# EAGLE design delay_line (EAGLE 9.0.0)
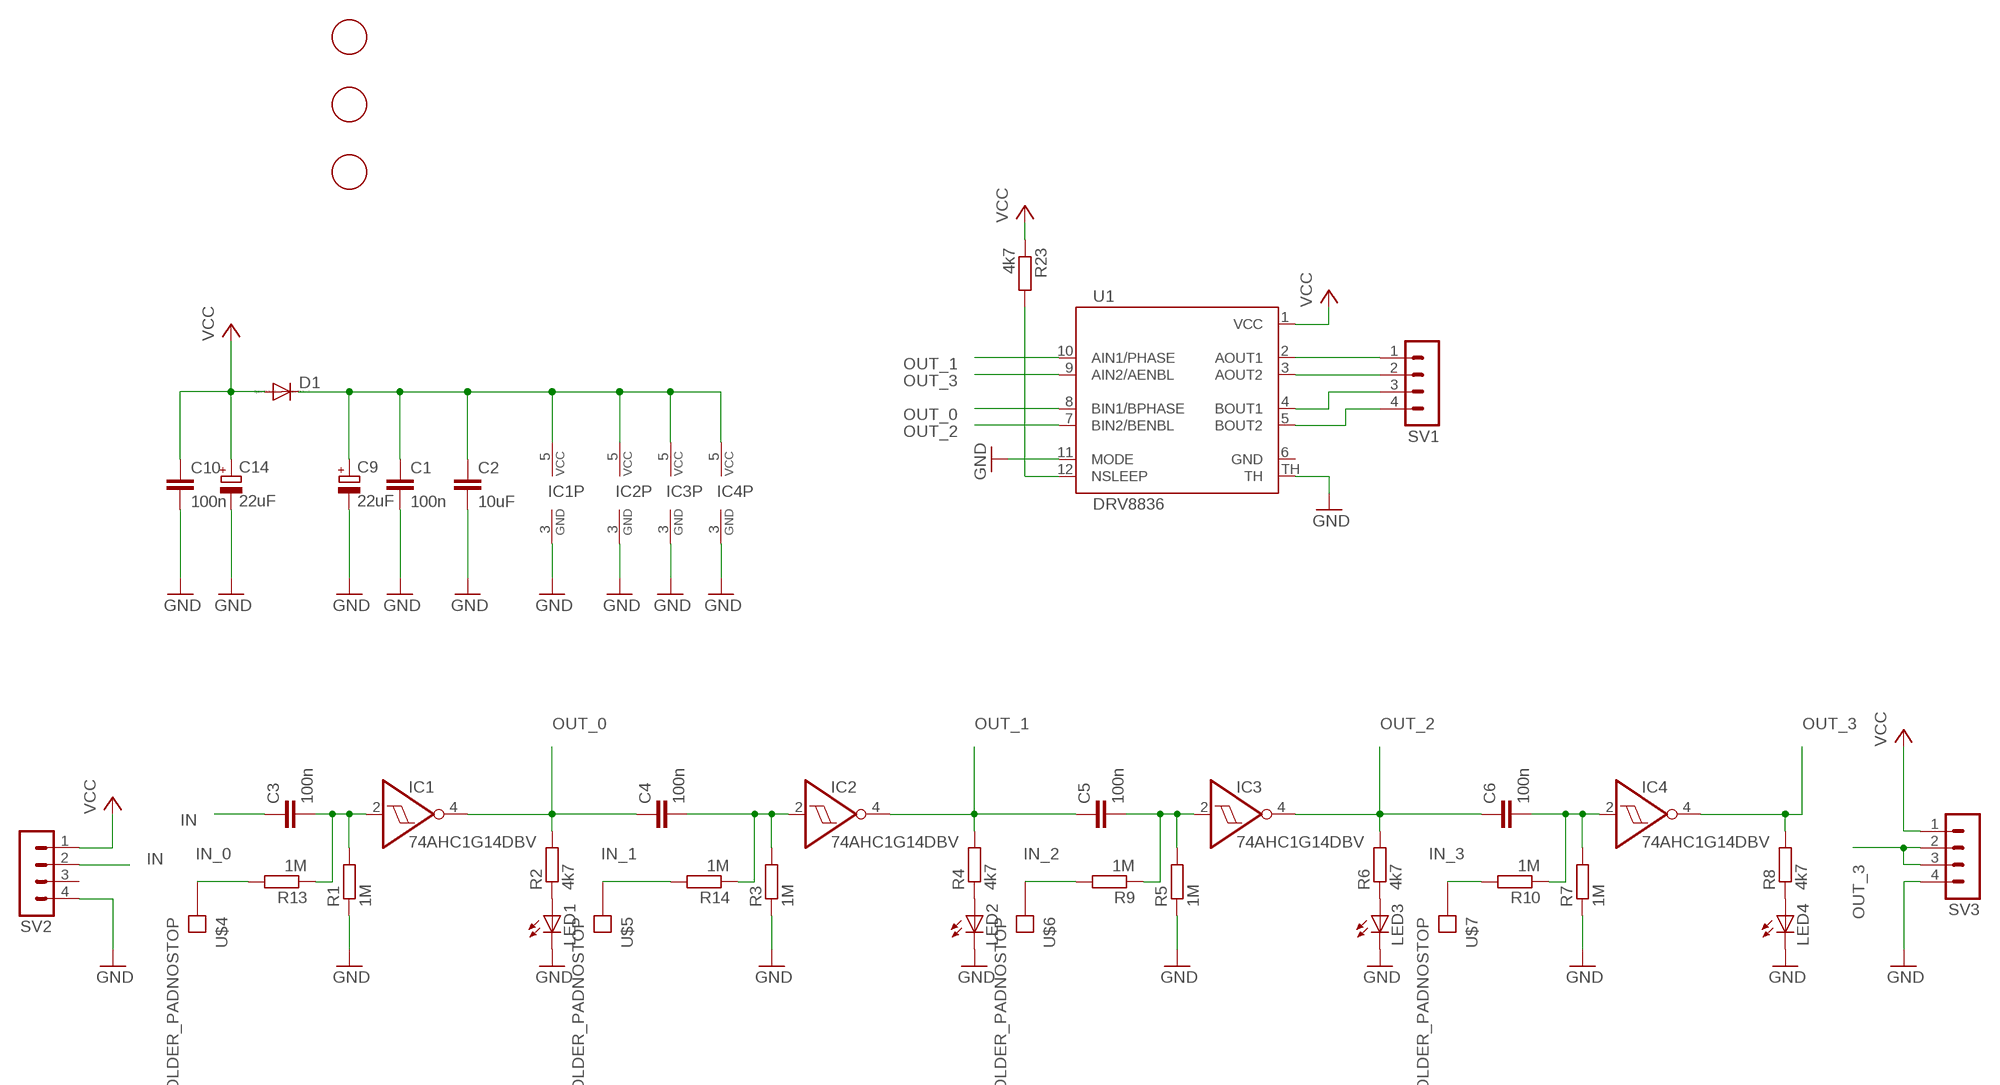
[diagram p0: schematic, sheet 1]

## Parts
C1  100n  C-EUC0805  [C0805]
C2  10uF  C-EUC0805  [C0805]
C3  100n  C-EUC0805  [C0805]
C4  100n  C-EUC0805  [C0805]
C5  100n  C-EUC0805  [C0805]
C6  100n  C-EUC0805  [C0805]
C9  22uF  CPOL-EU153CLV-0605  [153CLV-0605]
C10  100n  C-EUC0805  [C0805]
C14  22uF  CPOL-EU153CLV-0605  [153CLV-0605]
D1  DIODE-DO214AA  [DO214AA]
IC1  74AHC1G14DBV  [SOT23-5]
IC2  74AHC1G14DBV  [SOT23-5]
IC3  74AHC1G14DBV  [SOT23-5]
IC4  74AHC1G14DBV  [SOT23-5]
LED1  LEDSML1206  [SML1206]
LED2  LEDSML1206  [SML1206]
LED3  LEDSML1206  [SML1206]
LED4  LEDSML1206  [SML1206]
R1  1M  R-EU_M0805  [M0805]
R2  4k7  R-EU_M0805  [M0805]
R3  1M  R-EU_M0805  [M0805]
R4  4k7  R-EU_M0805  [M0805]
R5  1M  R-EU_M0805  [M0805]
R6  4k7  R-EU_M0805  [M0805]
R7  1M  R-EU_M0805  [M0805]
R8  4k7  R-EU_M0805  [M0805]
R9  1M  R-EU_M0805  [M0805]
R10  1M  R-EU_M0805  [M0805]
R13  1M  R-EU_M0805  [M0805]
R14  1M  R-EU_M0805  [M0805]
R23  4k7  R-EU_M0805  [M0805]
SV1  MA04-1  [MA04-1]
SV2  MA04-1  [MA04-1]
SV3  MA04-1  [MA04-1]
U1  DRV8836  [12WSON]
U$1  ADAFRUIT_FIDUCIAL  [ADAFRUIT_FIDUCIAL_1MM]
U$2  ADAFRUIT_FIDUCIAL  [ADAFRUIT_FIDUCIAL_1MM]
U$3  ADAFRUIT_FIDUCIAL  [ADAFRUIT_FIDUCIAL_1MM]
U$4  SOLDER_PADNOSTOP  [SOLDER_PAD_NOSTOP]
U$5  SOLDER_PADNOSTOP  [SOLDER_PAD_NOSTOP]
U$6  SOLDER_PADNOSTOP  [SOLDER_PAD_NOSTOP]
U$7  SOLDER_PADNOSTOP  [SOLDER_PAD_NOSTOP]

## Nets
GND: C1.2 C2.2 C9.- C10.2 C14.- IC1.3(GND) IC2.3(GND) IC3.3(GND) IC4.3(GND) LED1.C LED2.C LED3.C LED4.C R1.1 R3.1 R5.1 R7.1 SV2.4 SV3.4 U1.11(MODE) U1.TH
IN: C3.1 SV2.2
IN_0: R13.2 U$4.SPAD(NET)
IN_1: R14.2 U$5.SPAD(NET)
IN_2: R9.2 U$6.SPAD(NET)
IN_3: R10.2 U$7.SPAD(NET)
N$1: C1.1 C2.1 C9.+ D1.C IC1.5(VCC) IC2.5(VCC) IC3.5(VCC) IC4.5(VCC)
N$2: C3.2 IC1.2(I) R1.2 R13.1
N$3: C5.2 IC3.2(I) R5.2 R9.1
N$4: C4.2 IC2.2(I) R3.2 R14.1
N$5: LED1.A R2.1
N$6: LED3.A R6.1
N$7: LED2.A R4.1
N$8: C6.2 IC4.2(I) R7.2 R10.1
N$9: LED4.A R8.1
N$30: SV1.4 U1.5(BOUT2)
N$31: SV1.3 U1.4(BOUT1)
N$32: R23.2 U1.12(NSLEEP)
N$33: SV1.2 U1.3(AOUT2)
N$34: SV1.1 U1.2(AOUT1)
OUT_0: C4.1 IC1.4(O) R2.2 U1.8(BIN1/BPHASE)
OUT_1: C5.1 IC2.4(O) R4.2 U1.10(AIN1/PHASE)
OUT_2: C6.1 IC3.4(O) R6.2 U1.7(BIN2/BENBL)
OUT_3: IC4.4(O) R8.2 SV3.2 SV3.3 U1.9(AIN2/AENBL)
VCC: C10.1 C14.+ D1.A R23.1 SV2.1 SV3.1 U1.1(VCC)
Unconnected: SV2.3 U1.6(GND)

## Library data of the parts
C1-C6 C10 = resistor:C-EU: CAPACITOR, European symbol
C9 C14 = resistor:CPOL-EU: POLARIZED CAPACITOR, European symbol
D1 = diode:DIODE-: DIODE
IC1-IC4 = 74xx-little-de:74*1G14: Single Schmitt-Trigger Inverter Gate
LED1-LED4 = led:LED: LED OSRAM: - CHIPLED LG R971, LG N971, LY N971, LG Q971, LY Q971, LO R971, LY R971 LH N974, LH R974 LS Q976, LO Q976, LY Q976 LO Q996 - Hyper CHIPLED LW Q18S LB Q993, LB Q99A, LB R99A - SideLED LS A670, LO A670, LY A670, LG A670, LP A670 LB A673, LV A673, LT A673, LW A673 LH A674 LY A675 LS A676, LA A676, LO A676, LY A676, LW A676 LS A679, LY A679, LG A679 - Hyper Micro SIDELED® LS Y876, LA Y876, LO Y876, LY Y876 LT Y87S - SmartLED LW L88C, LW L88S LB L89C, LB L89S, LG L890 LS L89K, LO L89K, LY L89K LS L896, LA L896, LO L896, LY L896 - TOPLED LS T670, LO T670, LY T670, LG T670, LP T670 LSG T670, LSP T670, LSY T670, LOP T670, LYG T670 LG T671, LOG T671, LSG T671 LB T673, LV T673, LT T673, LW T673 LH T674 LS T676, LA T676, LO T676, LY T676, LB T676, LH T676, LSB T676, LW T676 LB T67C, LV T67C, LT T67C, LS T67K, LO T67K, LY T67K, LW E67C LS E67B, LA E67B, LO E67B, LY E67B, LB E67C, LV E67C, LT E67C LW T67C LS T679, LY T679, LG T679 LS T770, LO T770, LY T770, LG T770, LP T770 LB T773, LV T773, LT T773, LW T773 LH T774 LS E675, LA E675, LY E675, LS T675 LS T776, LA T776, LO T776, LY T776, LB T776 LHGB T686 LT T68C, LB T68C - Hyper Mini TOPLED® LB M676 - Mini TOPLED Santana® LG M470 LS M47K, LO M47K, LY M47K Source: http://www.osram.convergy.de LUXEON: - LUMILED® LXK2-PW12-R00, LXK2-PW12-S00, LXK2-PW14-U00, LXK2-PW14-V00 LXK2-PM12-R00, LXK2-PM12-S00, LXK2-PM14-U00 LXK2-PE12-Q00, LXK2-PE12-R00, LXK2-PE12-S00, LXK2-PE14-T00, LXK2-PE14-U00 LXK2-PB12-K00, LXK2-PB12-L00, LXK2-PB12-M00, LXK2-PB14-N00, LXK2-PB14-P00, LXK2-PB14-Q00 LXK2-PR12-L00, LXK2-PR12-M00, LXK2-PR14-Q00, LXK2-PR14-R00 LXK2-PD12-Q00, LXK2-PD12-R00, LXK2-PD12-S00 LXK2-PH12-R00, LXK2-PH12-S00 LXK2-PL12-P00, LXK2-PL12-Q00, LXK2-PL12-R00 Source: www.luxeon.com KINGBRIGHT: KA-3528ASYC Source: www.kingbright.com
R1-R10 R13 R14 R23 = resistor:R-EU_: RESISTOR, European symbol
SV1-SV3 = con-lstb:MA04-1: PIN HEADER; OC_FARNELL: unknown; OC_NEWARK: unknown
U1 = balto:DRV8836: Dual low voltage H-Bridge IC
U$1-U$3 = main_board:ADAFRUIT_FIDUCIAL: For use by pick and place machines to calibrate the vision/machine, 1mm By microbuilder.eu
U$4-U$7 = JCM:SOLDER_PAD

## Board
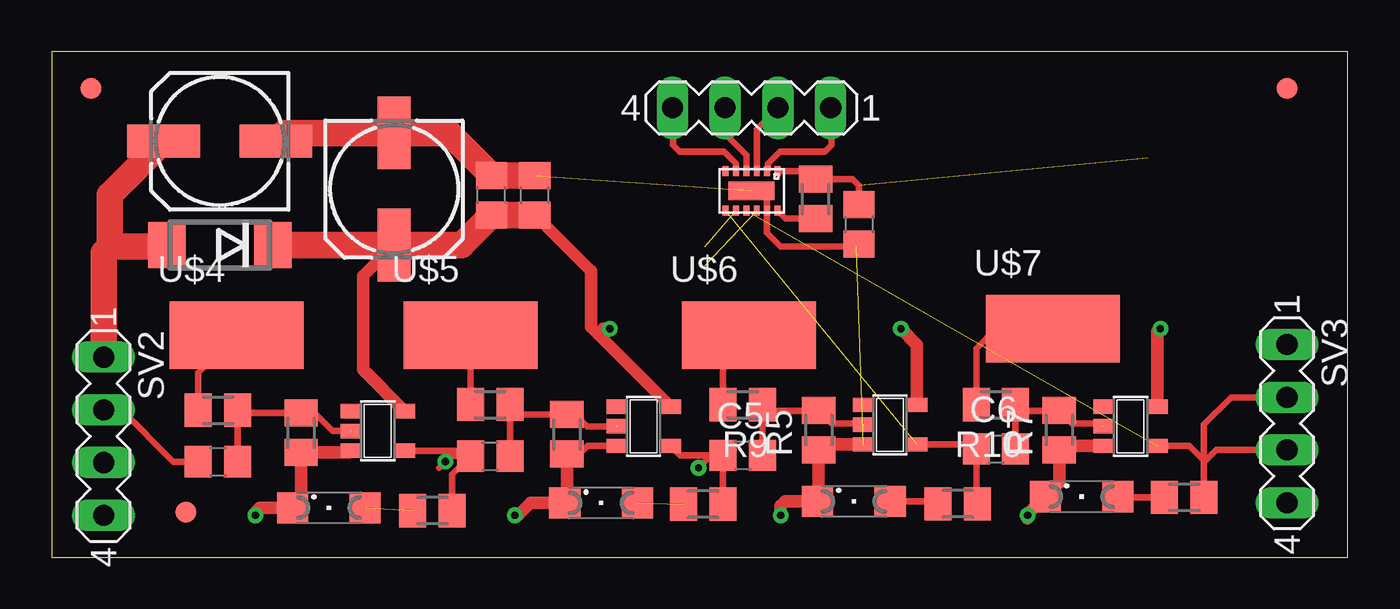
[diagram p1: board, top side]
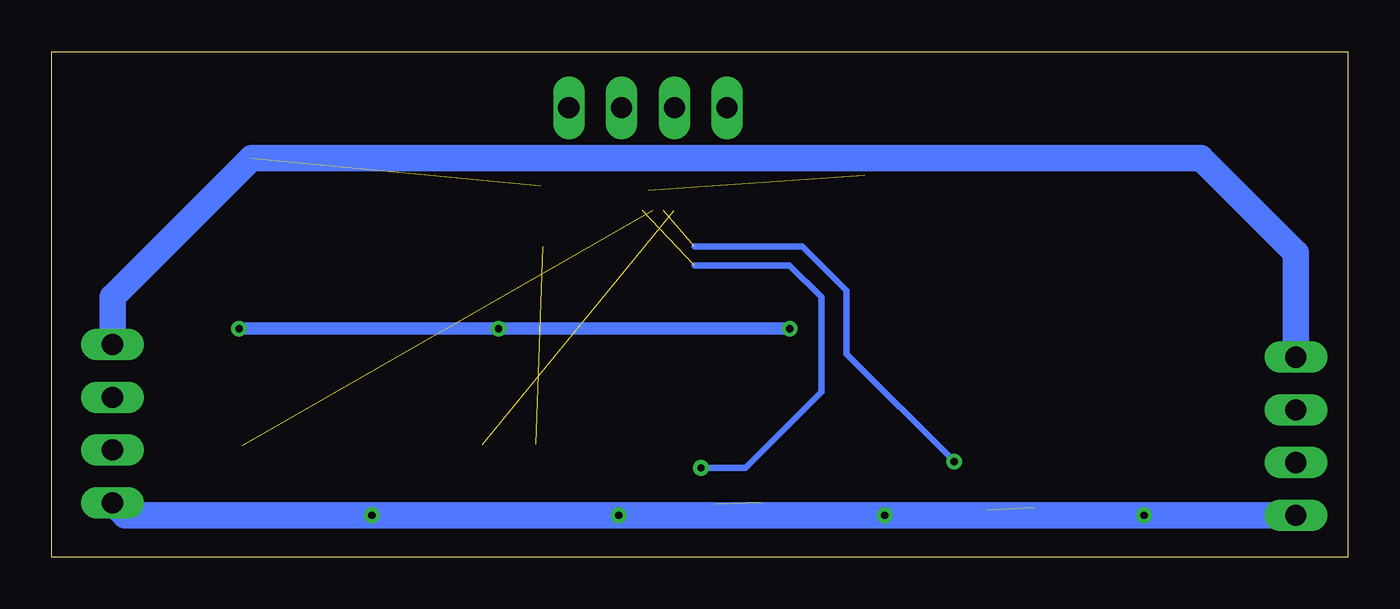
[diagram p2: board, bottom side, seen from below]

Size 62.4 x 24.34 mm. Coordinates in mm from the lower left corner, seen from the top.
Outline: 0,0 62.4,0 62.4,24.34 0,24.34 0,0
Copper layers (1*16): Top 0.035mm / dielectric 1.5mm / Bottom 0.035mm
Design rules "default": minimum track width 6mil, minimum drill 0.35mm, track to track 6mil, track to pad 6mil, pad to pad 6mil, via to via 6mil, smd to smd 6mil, copper to edge 40mil, drill to drill 6mil, minimum pad ring 10mil, minimum via ring 8mil, stop-mask expansion 4mil, vias tented up to drill 0mil, thermal gap 10mil

### Footprints (pad centres in the part's own frame; a part is rotated, then mirrored left to right if it is on the bottom)
C0805 = smd 1.3 x 1.5: 1 -0.95,0; 2 0.95,0
153CLV-0605 = smd 3.5 x 1.6: + 2.7,0; - -2.7,0
DO214AA = smd 1.8 x 2.2: A 2.55,0; C -2.55,0
SOT23-5 = smd 0.69 x 0.99: 1 -0.95,-1.29; 2 0,-1.29; 3 0.95,-1.29; 4 0.95,1.3; 5 -0.95,1.3
SML1206 = smd 1.5 x 1.5: A 1.75,0; C -1.75,0
M0805 = smd 1.3 x 1.6: 1 -0.95,0; 2 0.95,0
MA04-1 = drill 1.016 long: 1 -3.81,0; 2 -1.27,0; 3 1.27,0; 4 3.81,0
12WSON = smd 0.28 x 0.5: 1 -1.25,-0.95; 2 -0.75,-0.95; 3 -0.25,-0.95; 4 0.25,-0.95; 5 0.75,-0.95; 6 1.25,-0.95; 7 1.25,0.95; 8 0.75,0.95; 9 0.25,0.95; 10 -0.25,0.95; 11 -0.75,0.95; 12 -1.25,0.95 | smd 2.2 x 0.9: TH 0,0
ADAFRUIT_FIDUCIAL_1MM = smd 1 x 1: 1 0,0
SOLDER_PAD_NOSTOP = smd 6.452 x 3.251: SPAD 0,0

### Placement (x,y rotation side)
C1  23.26,17.43 90 top
C2  21.17,17.43 90 top
C3  8,4.6 0 top
C4  21.11,4.87 0 top
C5  33.27,4.91 0 top
C6  45.46,5.21 0 top
C9  16.48,17.73 270 top
C10  38.87,16.04 270 top
C14  8.09,20.04 180 top
D1  8.09,15.04 180 top
IC1  15.7,6.08 270 top
IC2  28.5,6.3 270 top
IC3  40.36,6.38 270 top
IC4  51.95,6.3 270 top
LED1  13.34,2.38 0 top
LED2  26.45,2.61 0 top
LED3  38.62,2.68 0 top
LED4  49.59,2.91 0 top
R1  12,5.99 90 top
R2  18.33,2.24 0 top
R3  24.8,5.91 90 top
R4  31.36,2.55 0 top
R5  36.93,6.13 90 top
R6  43.63,2.57 0 top
R7  48.51,6.13 90 top
R8  54.53,2.87 0 top
R9  33.27,7.35 180 top
R10  45.46,7.35 180 top
R13  8,7.08 180 top
R14  21.11,7.35 180 top
R23  36.78,17.26 270 top
SV1  33.7,21.65 180 top
SV2  2.49,5.82 270 top
SV3  59.48,6.43 270 top
U1  33.7,17.65 180 top
U$1  1.88,22.59 0 top
U$2  59.48,22.59 0 top
U$3  6.45,2.16 0 top
U$4  8.89,10.7 0 top
U$5  20.16,10.7 0 top
U$6  33.58,10.7 0 top
U$7  48.21,11 0 top

### Tracks (layer width: path | path; a pad name or v marks a point on that pad's centre or on a via)
GND  (via drill 0.35)  (2 unrouted)
  Top 0.305: U1.TH 34.12,17.65 34.19,17.71 34.45,17.45 U1.11 34.45,15.62 35.1,14.97 38.75,14.97 C10.2 | IC2.3 25.79,5.35 25.35,4.91 24.86,4.91 R3.1 | 48.69,5.35 R7.1 | 47.95,3.03 LED4.C | 36.93,2.74 LED3.C
  Top 0.61: IC1.3 14.32,5.04 R1.1 12,2.79 LED1.C 10.02,2.38 9.8,2.17 v9.8,2.01 | R3.1 24.8,2.71 LED2.C 23.05,2.61 22.45,2.01 v22.3,2.01 | LED4.C 46.99,2.06 v46.99,2.01 46.99,1.86 | IC4.3 48.69,5.35 | R7.1 48.51,3.58 47.95,3.03 | IC3.3 37.18,5.43 R5.1 36.93,2.74 | LED3.C 35.32,2.69 35.1,2.47 v35.1,2.01
  Top 1.27: C14.- 11.18,20.43 C9.- 19.12,20.43 C2.2 C1.2
  Bottom 1.27: SV3.4 58.87,2.01 v46.99,2.01 v35.1,2.01 v22.3,2.01 v9.8,2.01 SV2.4
IN
  Top 0.305: C3.1 5.84,4.6 3.35,7.09 SV2.2
IN_0
  Top 0.305: R13.2 7.05,8.86 U$4.SPAD
IN_1
  Top 0.305: R14.2 20.16,10.69 U$5.SPAD
IN_2
  Top 0.305: R9.2 32.32,9.44 U$6.SPAD
IN_3
  Top 0.305: R10.2 44.51,10.05 45.46,11 U$7.SPAD
N$1  (via drill 0.35)
  Top 0.61: C9.+ 14.98,13.54 14.98,9.04 IC1.5 | IC2.5 26.31,10.75 | 26.31,10.75 25.96,11.1 25.96,13.78 C1.1 | IC3.5 41.66,10.23 v40.89,11 | v26.87,11 26.57,11 26.31,10.75 | IC4.5 53.25,10.86 v53.39,11
  Top 1.27: D1.C C9.+ 19.73,15.03 C2.1 C1.1
  Bottom 0.61: v26.87,11 v40.89,11 v53.39,11
N$2
  Top 0.305: C3.2 R13.1 9.09,6.94 R1.2 12.65,6.94 13.51,6.08 IC1.2
N$3
  Top 0.305: IC3.2 39.02,6.43 37.54,6.43 36.93,7.04 | 36.93,7.04 R5.2 | 36.93,7.04 34.53,7.04 R9.1 C5.2
N$4
  Top 0.305: R14.1 | R14.1 C4.2 | R14.1 22.54,6.86 24.74,6.86 R3.2 25.22,6.86 25.78,6.31 IC2.2
N$5  (1 unrouted)
N$6
  Top 0.305: LED3.A 42.57,2.69 R6.1
N$7  (1 unrouted)
N$8
  Top 0.305: IC4.2 50.53,6.43 49.12,6.43 48.51,7.04 | 48.51,7.04 R7.2 | C6.2 R10.1 46.72,7.04 48.51,7.04
N$9
  Top 0.305: R8.1 51.38,2.87 LED4.A
N$30
  Top 0.305: U1.5 32.95,18.95 32.36,19.54 30.22,19.54 29.92,19.84 29.92,21.61 SV1.4
N$31
  Top 0.305: U1.4 33.45,19.36 32.36,20.45 32.36,21.58 SV1.3
N$32
  Top 0.305: U1.12 35.34,16.31 R23.2
N$33
  Top 0.305: U1.3 33.95,20.63 SV1.2
N$34
  Top 0.305: U1.2 34.49,18.64 34.49,18.96 35.07,19.54 37.23,19.54 37.54,19.84 37.54,21.61 SV1.1
OUT_0  (via drill 0.35)  (1 unrouted)
  Top 0.305: IC1.4 19.9,5.13 C4.1 | R2.2 19.28,3.99 C4.1 | C4.1 19.21,4.87 v18.95,4.6 18.64,4.3
  Bottom 0.305: v18.95,4.6 24.13,9.79 24.13,12.83 26.26,14.97 31.44,14.97
OUT_1  (via drill 0.35)  (1 unrouted)
  Top 0.305: IC2.4 30.24,4.91 C5.1 | C5.1 32.32,2.56 R4.2 | C5.1 31.75,4.91 v31.14,4.3
  Bottom 0.305: v31.14,4.3 29,4.3 25.35,7.96 25.35,12.53 26.87,14.05 31.44,14.05
OUT_2  (1 unrouted)
  Top 0.305: R6.2 44.51,2.64 C6.1 44.3,5.43 IC3.4
OUT_3  (1 unrouted)
  Top 0.305: IC4.4 54.77,5.35 55.52,4.6 | 55.52,4.6 55.48,4.56 | 55.48,4.56 R8.2 | SV3.3 56.08,5.16 55.52,4.6 | SV3.2 56.79,7.7 55.48,6.39 55.48,4.56
VCC  (1 unrouted)
  Top 0.305: U1.1 36.39,18.6 R23.1 38.57,18.21 38.87,17.91 C10.1
  Top 1.27: D1.A 5.46,14.97 2.79,14.97 | 2.79,14.97 2.49,14.66 SV2.1 | C14.+ 2.79,17.44 2.79,14.97
  Bottom 1.27: SV3.1 59.48,12.53 52.78,19.23 7.06,19.23 2.49,14.66 SV2.1